# EAGLE schematic extension-board (EAGLE 8.4.1)
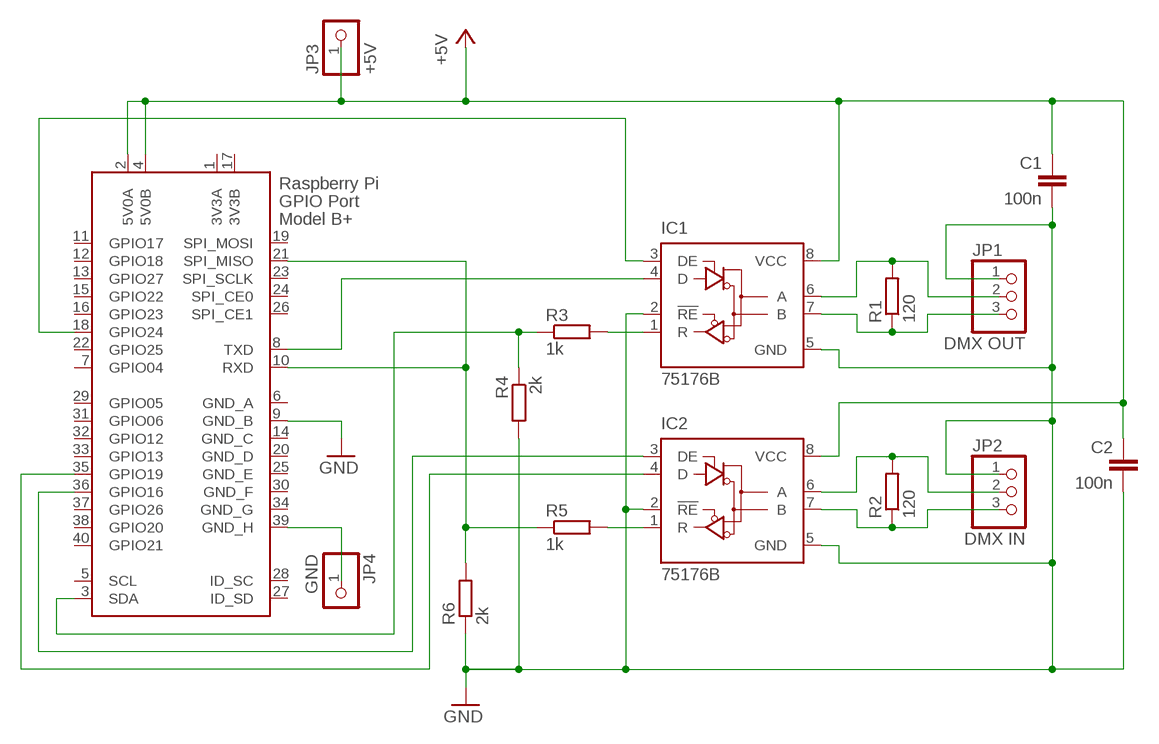
[diagram p0: schematic, sheet 1]

## Parts
C1  100n  C5/3  [C5B3]
C2  100n  C5/3  [C5B3]
IC1  75176B  75176AP  [DIL08]
IC2  75176B  75176AP  [DIL08]
JP1  DMX OUT  PINHD-1X3  [1X03]
JP2  DMX IN  PINHD-1X3  [1X03]
JP3  +5V  PINHD-1X1  [1X01]
JP4  GND  PINHD-1X1  [1X01]
R1  120  R-EU_0204/2V  [0204V]
R2  120  R-EU_0204/2V  [0204V]
R3  1k  R-EU_0204/7  [0204/7]
R4  2k  R-EU_0204/2V  [0204V]
R5  1k  R-EU_0204/7  [0204/7]
R6  2k  R-EU_0204/7  [0204/7]
X1  RASPI_GPIO_B+#_PIN  [RASPI_GPIO_B+_PIN]

## Nets
+5V: C1.1 C2.1 IC1.8(VCC) IC2.8(VCC) JP3.1 X1.2(5V0A) X1.4(5V0B)
GND: C1.2 C2.2 IC1.2(!RE) IC1.5(GND) IC2.2(!RE) IC2.5(GND) JP1.1 JP2.1 R4.2 R6.1 X1.9(GND_B)
N$1: IC2.1(R) R5.2
N$2: R5.1 R6.2 X1.10(RXD) X1.21(SPI_MISO)
N$3: IC1.6(A) JP1.2 R1.2
N$4: R3.1 R4.1 X1.3(SDA)
N$5: IC2.4(D) X1.35(GPIO19)
N$6: IC1.4(D) X1.8(TXD)
N$7: IC1.7(B) JP1.3 R1.1
N$8: IC2.7(B) JP2.3 R2.1
N$9: IC2.6(A) JP2.2 R2.2
N$10: IC2.3(DE) X1.36(GPIO16)
N$11: IC1.3(DE) X1.18(GPIO24)
N$12: JP4.1 X1.39(GND_H)
N$14: IC1.1(R) R3.2
Unconnected: X1.1(3V3A) X1.5(SCL) X1.6(GND_A) X1.7(GPIO04) X1.11(GPIO17) X1.12(GPIO18) X1.13(GPIO27) X1.14(GND_C) X1.15(GPIO22) X1.16(GPIO23) X1.17(3V3B) X1.19(SPI_MOSI) X1.20(GND_D) X1.22(GPIO25) X1.23(SPI_SCLK) X1.24(SPI_CE0) X1.25(GND_E) X1.26(SPI_CE1) X1.27(ID_SD) X1.28(ID_SC) X1.29(GPIO05) X1.30(GND_F) X1.31(GPIO06) X1.32(GPIO12) X1.33(GPIO13) X1.34(GND_G) X1.37(GPIO26) X1.38(GPIO20) X1.40(GPIO21)

## Library data of the parts
C1 C2 = capacitor-wima:C: CAPACITOR naming: grid - package width
IC1 IC2 = 751xx:75176A: DIFFERENTIAL BUS TRANSCEIVER Source: http://focus.ti.com/lit/ds/symlink/sn75176a.pdf
JP1 JP2 = pinhead:PINHD-1X3: PIN HEADER
JP3 JP4 = pinhead:PINHD-1X1: PIN HEADER
R1-R6 = resistor:R-EU_: RESISTOR, European symbol
X1 = raspberrypi_bastelstube_v13:RASPI_GPIO_B+#: 2x20 header connector, all pins connected